# Altium project ESP32W_Zzed.PrjPcb
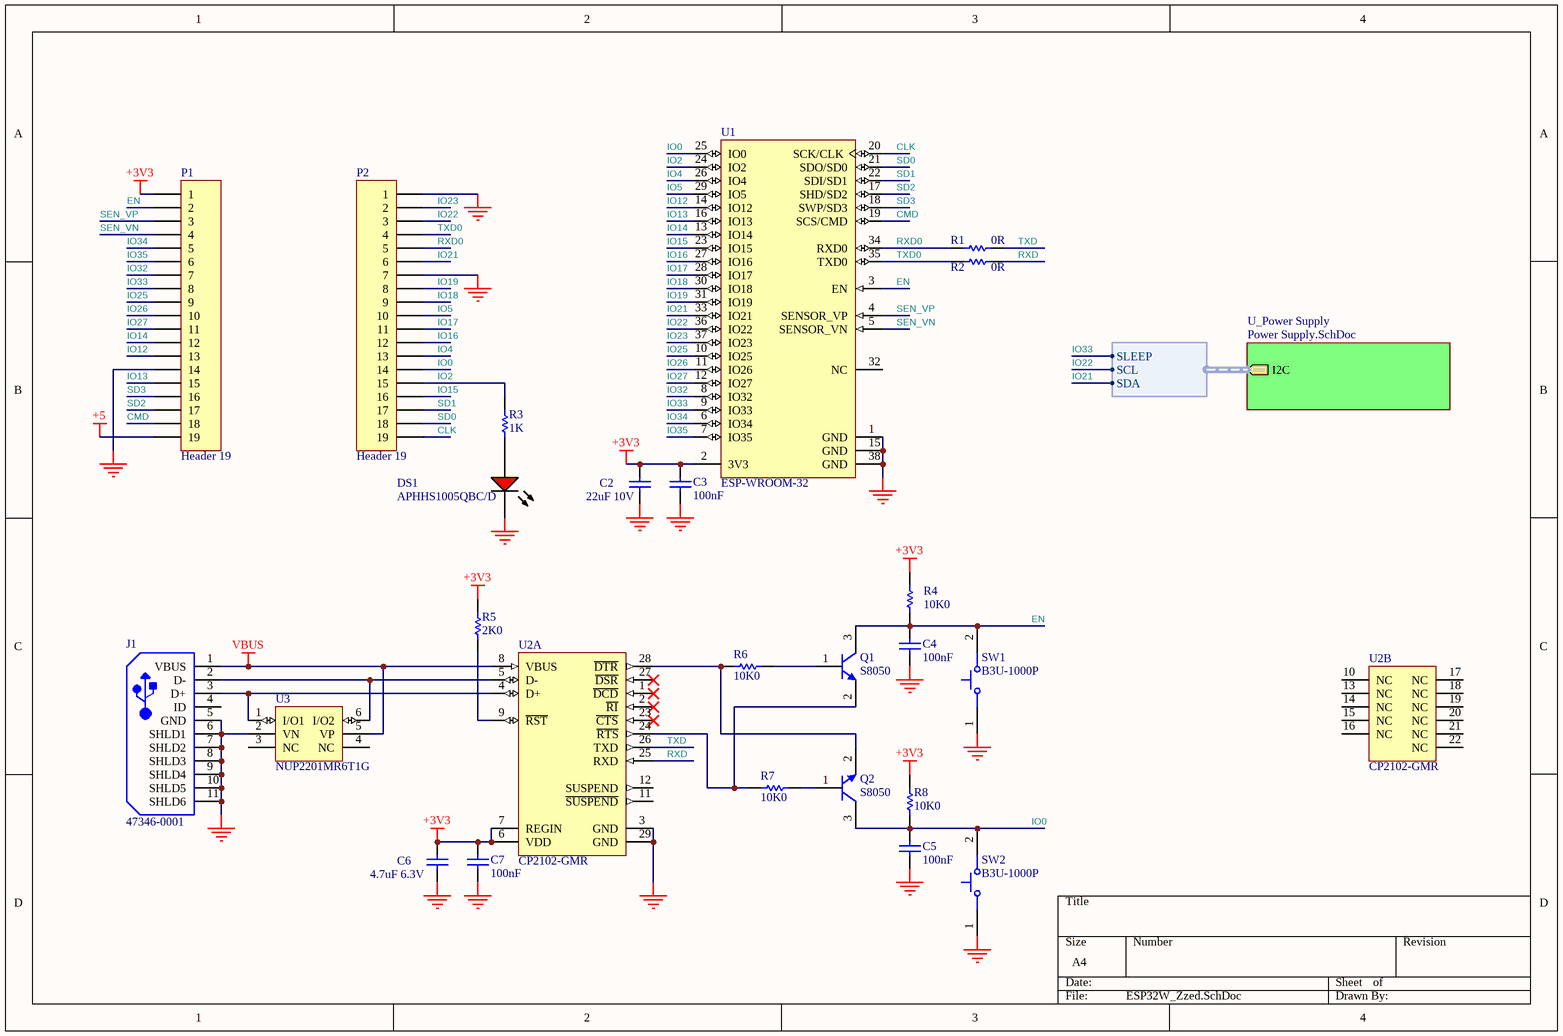
[diagram p0: ESP32W_Zzed.SchDoc]
2 sheets, 65 parts. Net scope: hierarchical (ports join the sheet entries above them; power ports are global).
Board file: ESP32W_Zzed.PcbDoc
Sheets:
  ESP32W_Zzed.SchDoc
    U_Power Supply = Power Supply.SchDoc

## Sheet ESP32W_Zzed.SchDoc
size A4

### Parts
C2  22uF 10V  [CAPC0805(2012)145_L]
C3  100nF  [CAPC0402(1005)60_L]
C4  100nF  [CAPC0402(1005)60_L]
C5  100nF  [CAPC0402(1005)60_L]
C6  4.7uF 6.3V  [CAPC0402(1005)60_L]
C7  100nF  [CAPC0402(1005)60_L]
DS1  APHHS1005QBC/D  [KING-0402_V]
J1  47346-0001  [MOLX-47346-0001-5_V]
P1  Header 19  [HDR1X19]
P2  Header 19  [HDR1X19]
Q1  S8050  [KOCN-SOT23-3_L]
Q2  S8050  [KOCN-SOT23-3_L]
R1  0R  [RESC0402(1005)_L]
R2  0R  [RESC0402(1005)_L]
R3  1K  [RESC0402(1005)_L]
R4  10K0  [RESC0402(1005)_L]
R5  2K0  [RESC0402(1005)_L]
R6  10K0  [RESC0402(1005)_L]
R7  10K0  [RESC0402(1005)_L]
R8  10K0  [RESC0402(1005)_L]
SW1  B3U-1000P  [OMRON-B3U-1000_V]
SW2  B3U-1000P  [OMRON-B3U-1000_V]
U1  ESP-WROOM-32  [OLMX-ESP-WROOM-32]
U2  CP2102-GMR  [SLAB-QFN-28-3125x3125TP_N]  (parts A,B of 2)
U3  NUP2201MR6T1G  [ONSC-TSOP-6_V]

### Sub-sheets
U_Power Supply = Power Supply.SchDoc: I2C (out, harness I2C)

### Harnesses
I2C: SLEEP, SCL, SDA

### Nets
+3V3: C2.2 C3.2 C6.2 C7.2 P1.1 R4.2 R5.2 R8.1 U1.2(3V3) U2.6(VDD) U2.7(REGIN)
+5: P1.19
GND: C2.1 C3.1 C4.1 C5.1 C6.1 C7.1 DS1.2(K) J1.5(GND) J1.6(SHLD1) J1.7(SHLD2) J1.8(SHLD3) J1.9(SHLD4) J1.10(SHLD5) J1.11(SHLD6) P1.14 P2.1 P2.7 SW1.1 SW2.1 U1.1(GND) U1.15(GND) U1.38(GND) U2.3(GND) U2.29(GND) U3.2(VN)
VBUS: J1.1(VBUS) U2.8(VBUS) U3.5(VP)
CLK: P2.19 U1.20(SCK/CLK)
CMD: P1.18 U1.19(SCS/CMD)
EN: C4.2 P1.2 Q1.3(COLLECTOR) R4.1 SW1.2 U1.3(EN)
IO0: C5.2 P2.14 Q2.3(COLLECTOR) R8.2 SW2.2 U1.25(IO0)
IO2: P2.15 R3.2 U1.24(IO2)
IO4: P2.13 U1.26(IO4)
IO5: P2.10 U1.29(IO5)
IO12: P1.13 U1.14(IO12)
IO13: P1.15 U1.16(IO13)
IO14: P1.12 U1.13(IO14)
IO15: P2.16 U1.23(IO15)
IO16: P2.12 U1.27(IO16)
IO17: P2.11 U1.28(IO17)
IO18: P2.9 U1.30(IO18)
IO19: P2.8 U1.31(IO19)
IO21: P2.6 U1.33(IO21) ; sheet U_Power Supply/I2C.SDA
IO22: P2.3 U1.36(IO22) ; sheet U_Power Supply/I2C.SCL
IO23: P2.2 U1.37(IO23)
IO25: P1.9 U1.10(IO25)
IO26: P1.10 U1.11(IO26)
IO27: P1.11 U1.12(IO27)
IO32: P1.7 U1.8(IO32)
IO33: P1.8 U1.9(IO33) ; sheet U_Power Supply/I2C.SLEEP
IO34: P1.5 U1.6(IO34)
IO35: P1.6 U1.7(IO35)
RXD: R2.2 U2.25(RXD)
RXD0: P2.5 R1.1 U1.34(RXD0)
SD0: P2.18 U1.21(SDO/SD0)
SD1: P2.17 U1.22(SDI/SD1)
SD2: P1.17 U1.17(SHD/SD2)
SD3: P1.16 U1.18(SWP/SD3)
SEN_VN: P1.4 U1.5(SENSOR_VN)
SEN_VP: P1.3 U1.4(SENSOR_VP)
TXD: R1.2 U2.26(TXD)
TXD0: P2.4 R2.1 U1.35(TXD0)
NetDS1_1: DS1.1(A) R3.1
NetJ1_2: J1.2(D-) U2.5(D-) U3.6(I/O2)
NetJ1_3: J1.3(D+) U2.4(D+) U3.1(I/O1)
NetQ1_1: Q1.1(BASE) R6.2
NetQ1_2: Q1.2(EMITTER) R7.1 U2.24(~{RTS})
NetQ2_1: Q2.1(BASE) R7.2
NetQ2_2: Q2.2(EMITTER) R6.1 U2.28(~{DTR})
NetR5_1: R5.1 U2.9(~{RST})

Not connected (* = marked no-connect by the designer): J1 4(ID); U1 32(NC); U2 1(~{DCD})* 2(~{RI})* 10(NC) 11(~{SUSPEND}) 12(SUSPEND) 13(NC) 14(NC) 15(NC) 16(NC) 17(NC) 18(NC) 19(NC) 20(NC) 21(NC) 22(NC) 23(~{CTS})* 27(~{DSR})*; U3 3(NC) 4(NC)

### Library data of the parts
C2 = CMP-1036-04942-1: CAP 22uF 10V ±10% 0805 (2012 Metric) Thickness 1.45mm SMD; Case-EIA: 0805; Case-Metric: 2012; Tolerance: Â±10%; Rated Voltage: 10 V; Max Thickness: 1.45 mm; Value: 22uF; Technology: SMT
C3-C5 C7 = CMP-1034-02077-1: CAP 100nF 50V ±10% 0402 (1005 Metric) Thickness 0.6mm SMD; Case-Metric: 1005; Case-EIA: 0402; Tolerance: Â±10%; Value: 100nF; Rated Voltage: 50 V; Technology: SMT; Max Thickness: 0.6 mm
C6 = CMP-1034-02137-1: CAP 4.7uF 6.3V ±20% 0402 (1005 Metric) Thickness 0.6mm SMD; Case-Metric: 1005; Case-EIA: 0402; Tolerance: Â±20%; Technology: SMT; Max Thickness: 0.6 mm; Rated Voltage: 6.3 V; Value: 4.7uF
DS1 = CMP-2000-05787-1: Red Water Clear Chip LED Lamp, 1.95 V, 20 mA, -40 to 85 degC, 2-Pin SMD (0402), RoHS, Tape and Reel; Manufacturer: Kingbright; Lens Style/Size: RectanglewithFlatTop,0.8mmx0.5mm; Wavelength - Dominant: 630nm; 3D Model: APHHS1005x.sldprt / APHHS1005x.pro / APHHS1005x.igs / APHHS1005x.stp; Current - Test: 20mA; Other Names: 754-1104-2; Millicandela Rating: 220mcd; Wavelength - Peak: 650nm; Online Catalog: 0402RectanglewithFlatTopChipLEDs; Viewing Angle: 120°; Voltage - Forward (Vf) (Typ): 1.95V; Catalog Drawings: APHHS1005SeriesSide / APHHS1005SeriesTop; Height: 0.60mm; Datasheet URL: https://datasheet.ciiva.com/4689/aphhs1005surck-32322-4689068.pdf; Datasheet Version: Rev. 8, 08/2010; Color: Red; Standard Package: 2,000; Packaging: Tape&Reel(TR); Manufacturer URL: http://www.kingbright.com/; Size / Dimension: 1.00mmLx0.50mmW; Package Description: 2-Pin Surface Mount Device, Body 1 x 0.5 mm; Package / Case: 0402(1005Metric); Family: LEDIndication-Discrete; Category: Optoelectronics; Lens Type: Clear; Mounting Technology: SurfaceMount; Package Reference: 0402; Mounting Type: SurfaceMount
J1 = CMP-2000-05246-1: Micro-USB B Receptacle with Flange, -30 to 85 degC, 5-Pin SMD, RoHS, Tape and Reel; Manufacturer: Molex; Number of Contacts: 5; Body Orientation: RightAngle; Maximum Voltage Rating: 30VAC; Pitch: 0.65mm; Maximum Current Rating: 1.8/ContactA; Number of Ports: 1; Gender: RCP; Operating Temperature: -30to85C; Part No: 47346-0001; Color: Black; Termination Method: Solder; Contact Plating: GoldOverPalladiumNickelOverNickel; Dimension: 7.8x5.43x2.94mm; Number of Terminals: 5; Datasheet Version: Dec-13; Datasheet URL: https://datasheet.ciiva.com/30075/304740473460001-io-nectors-30075527.pdf; Contact Material: CopperAlloy; RoHS: Yes; Housing Material: LiquidCrystalPolymer; Manufacturer URL: http://www.molex.com/; Packaging: EmbossedTapeandReel; Mounting: SurfaceMount; Type: MicroUSBTypeB
P1 P2 = Header 19: Header, 19-Pin; LatestRevisionDate: 17-Jul-2002; LatestRevisionNote: Re-released for DXP Platform.; Publisher: Altium Limited
Q1 Q2 = CMP-0564-00001-2: NPN Transistor, 0.8 A Collector Current, 3-Pin SOT23, RoHS, Tape and Reel; Manufacturer: Koo Chin; IEBO (max): 0.1 uA; V (BR) EBO (min): 5 V; VCE (sat) (max): 0.6 V; fT(min): 150 MHz; V (BR) CEO (min): 25 V; V (BR) CBO (min): 40 V; VBE (sat) (max): 1.2 V; NPN/PNP: NPN; PackageDescription: 3-Pin Small Out-Line Transistor, Body 1.3 x 2.9 mm, Pitch 0.95 mm; ComponentLink3Description: Package Specification; ComponentLink1Description: Manufacturer URL; RoHS: TRUE; ICEO (max): 0.1 uA; ComponentLink1URL: http://www.hz-dz.net/; PartNumber: S8050; ComponentLink2URL: http://www.hz-dz.net/UploadFiles/2009812164318190.pdf; Packing: Tape and Reel; ComponentLink3URL: http://galaxycn.com/jsp/upload/S8050.pdf; ICBO (max): 0.1 uA; Mounting Technology: Surface Mount; PackageReference: SOT23-3; ComponentLink2Description: Datasheet; DatasheetVersion: 17/08/2009
R1 R2 = CMP-1011-00001-1: Jumper 0402 (1005 Metric); Tolerance: None; Case-Metric: 1005; Case-EIA: 0402; Value: 0.00 Ohm; Power: None; Technology: SMT
R3 = CMP-1011-00510-1: 1K 0.063W 1% 0402 (1005 Metric)  SMD; Case-EIA: 0402; Value: 1000.00 Ohm; Case-Metric: 1005; Technology: SMT; Tolerance: 1 %; Power: 0.063 W
R4 R6-R8 = CMP-1011-00623-1: 10K 0.063W 1% 0402 (1005 Metric)  SMD; Case-Metric: 1005; Value: 10000.00 Ohm; Case-EIA: 0402; Tolerance: 1 %; Technology: SMT; Power: 0.063 W
R5 = CMP-1011-00542-1: 2K 0.063W 1% 0402 (1005 Metric)  SMD; Case-EIA: 0402; Case-Metric: 1005; Value: 2000.00 Ohm; Technology: SMT; Power: 0.063 W; Tolerance: 1 %
SW1 SW2 = CMP-2100-03586-1: Ultra-Small Tactile Switch, 0.05 A, 12 V, -25 to 70 degC, 2-Pin SMD, RoHS, Tape and Reel; Manufacturer: Omron Electronic Components; Operating Force: 1.5N; Current Rating: 50mA; Voltage Rating (DC): 12V; Electrical Life: 200000Cycles; Actuator Length: 0.4mm; Insulation Resistance: 100MOhm; Switch Travel: 0.15mm; Throw Configuration: SPST; Illumination Type: Illuminated; Width: 3mm; Weight: 0.022g; Datasheet Version: 42005.0; Datasheet URL: http://www.omron.com/ecb/products/pdf/en-b3u.pdf; Height: 1.2mm; Package Quantity: 1; REACH SVHC: Unknown; Contact Current Rating: 50mA; Contact Material: Silver; Max Current Rating: 50mA; Package Reference: B3U-1000; Termination: SMD/SMT; Packaging: TapeandReel; Manufacturer URL: http://www.omron.com/; RoHSCompliant: true; Mount: SurfaceMount; Length: 4mm; Min Operating Temperature: -25degC; Depth: 2.5mm; Lead Free: LeadFree; Case/Package: SMD/SMT; Package Description: 2-Pin Surface Mount Device, Body 3 x 2.5 mm; Max Operating Temperature: 70degC; Orientation: Straight
U1 = CMP-2000-07454-1: Espressif System, 2.7 to 3.6 V, -40 to 85 degC, 38-Pin SMD; Manufacturer: Olimex; Package Description: 38-Pin Surface Mount Device, Body 18 x 25.5 mm, Pitch 1.27 mm; Manufacturer URL: https://www.olimex.com; RoHSCompliant: false; Mounting Technology: SurfaceMount; Datasheet Version: Rev. 2.1, 09/2017; Datasheet URL: http://www.espressif.com/sites/default/files/documentation/esp-wroom-32_datasheet_en.pdf; Package Reference: ESP-WROOM-32
U2 = CMP-2000-04924-1: Single-Chip USB to URAT Bridge, 3.3 V, -40 to 85 degC, 28-Pin QFN, RoHS, Tape and Reel; Manufacturer: Silicon Labs; Interface Circuit Standard 1: RS-232; Transmitter and Receiver FIFO Counter: No; Supply Current: 26mA; Operating Supply Voltage (Min): 3V; Operating Supply Voltage (Typ): 3.3V; Data Rate: 1000kbps; Operating Supply Voltage (Max): 3.6V; Number of Channels: 1; Package URL: http://www.silabs.com/Support%20Documents/TechnicalDocs/C8051T61x.pdf; Operating Temperature (Max): 85C; Datasheet URL: http://www.mouser.com/ds/2/368/CP2102-9-247052.pdf; Operating Temperature Classification: Industrial; Operating Temperature (Min): -40C; Package Description: 28-Pin Quad-Flat No-Leads Package, Body 5 x 5 mm, Pitch 0.5 mm; Manufacturer URL: http://www.silabs.com/; Rad Hardened: No; Package Reference: QFN-28; Pin Count: 28; Packaging: TapeandReel; Mounting: SurfaceMount; Package Type: QFNEP; Datasheet Version: Rev. 1.6, 12/2013; PartId: 1
U3 = CMP-0260-00001-1: ESD Protection Diodes with Low Clamping Voltage; Peak Power Dissipation: 500 W; ComponentLink3Description: Package Specification; ComponentLink3URL: http://www.onsemi.com/pub_link/Collateral/318G-02.PDF; PartNumber: NUP2201MR6T1G; Mounting Technology: Surface Mount; ComponentLink1Description: Manufacturer URL; ComponentLink2URL: http://www.onsemi.cn/pub_link/Collateral/NUP2201MR6-D.PDF; PackageDescription: 6-Pin Thin Small Outline, 3 x 1.5 mm Body, 0.95 mm Pitch; ComponentLink2Description: Datasheet; ComponentLink1URL: http://www.onsemi.com/; Storage Temperature: -55 to 125 degC; DatasheetVersion: Rev. 4, 02/2013; PackageReference: TSOP-6; PackageVersion: Rev. V, 6/2012

## Sheet Power Supply.SchDoc
size A4
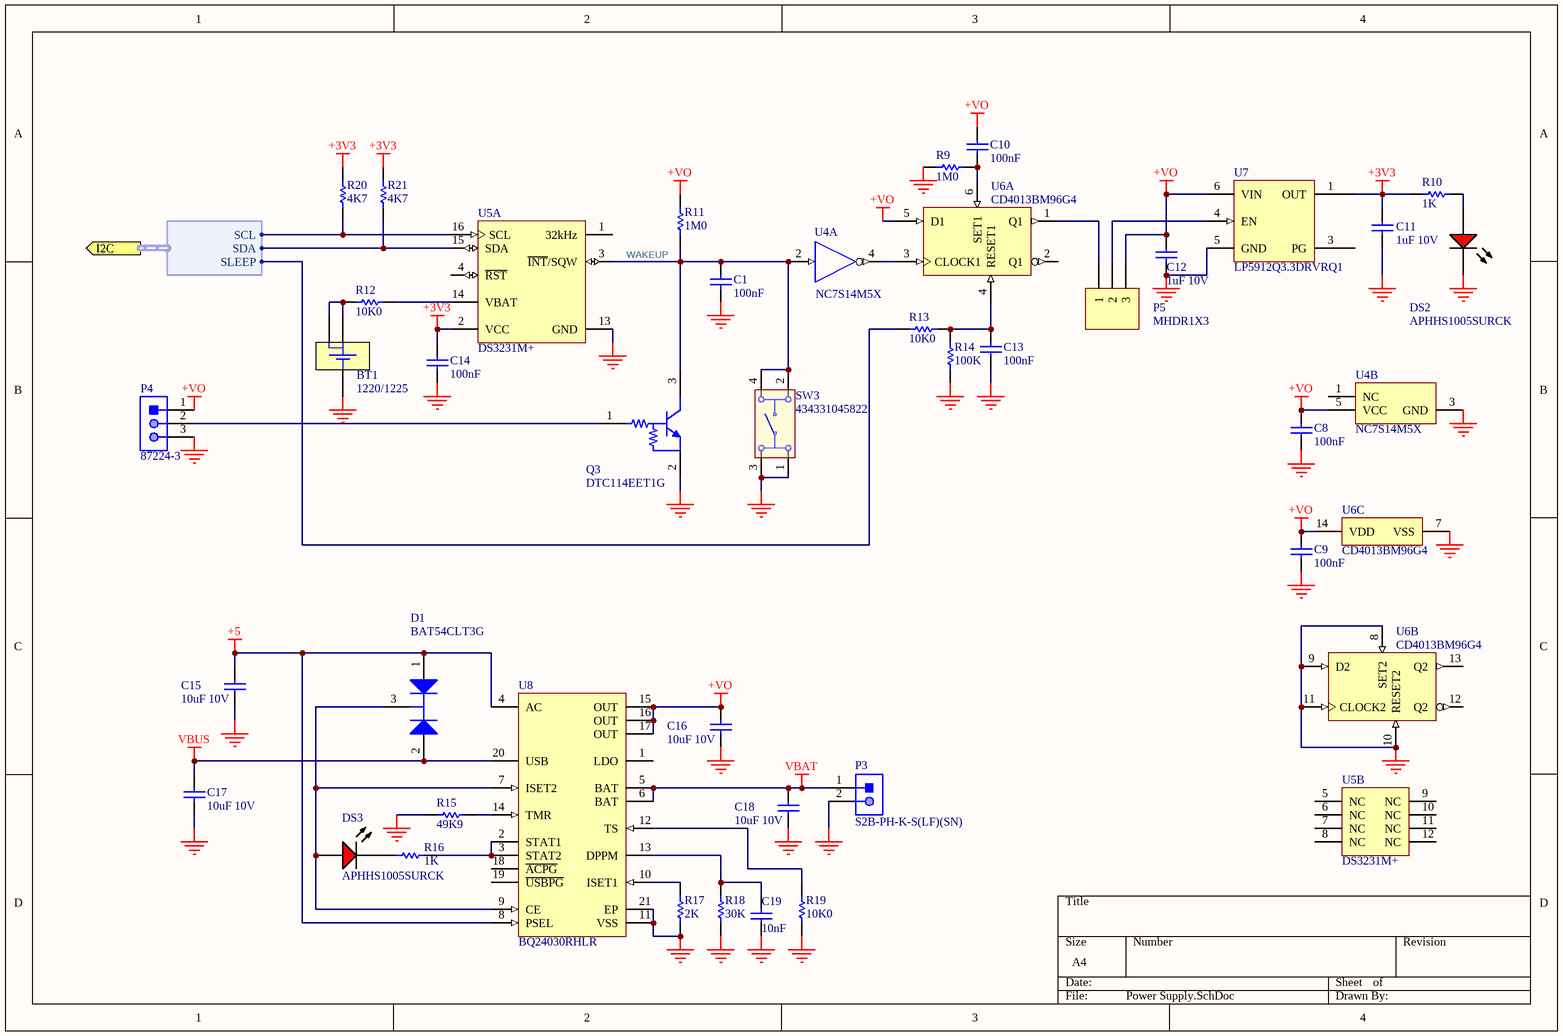
[diagram p1: Power Supply.SchDoc]

### Parts
BT1  1220/1225  [KEYSTONE 3000]
C1  100nF  [CAPC0402(1005)60_L]
C8  100nF  [CAPC0402(1005)60_L]
C9  100nF  [CAPC0402(1005)60_N]
C10  100nF  [CAPC0402(1005)60_L]
C11  1uF 10V  [CAPC0402(1005)60_L]
C12  1uF 10V  [CAPC0402(1005)60_L]
C13  100nF  [CAPC0402(1005)60_L]
C14  100nF  [CAPC0402(1005)60_L]
C15  10uF 10V  [CAPC0603(1608)100_L]
C16  10uF 10V  [CAPC0603(1608)100_L]
C17  10uF 10V  [CAPC0603(1608)100_L]
C18  10uF 10V  [CAPC0603(1608)100_L]
C19  10nF  [CAPC0402(1005)60_L]
D1  BAT54CLT3G  [ONSC-SOT-23-3-318-08_V]
DS2  APHHS1005SURCK  [KING-0402_V]
DS3  APHHS1005SURCK  [KING-0402_V]
P3  S2B-PH-K-S(LF)(SN)  [JST-S2B-PH-K-S_V]
P4  87224-3  [TECO-87224-3_V]
P5  MHDR1X3  [MHDR1X3]
Q3  DTC114EET1G  [ONSC-SC-75-3-463-01_V]
R9  1M0  [RESC0402(1005)_L]
R10  1K  [RESC0402(1005)_L]
R11  1M0  [RESC0402(1005)_L]
R12  10K0  [RESC0402(1005)_L]
R13  10K0  [RESC0402(1005)_L]
R14  100K  [RESC0402(1005)_L]
R15  49K9  [RESC0402(1005)_L]
R16  1K  [RESC0402(1005)_L]
R17  2K  [RESC0402(1005)_L]
R18  30K  [RESC0402(1005)_L]
R19  10K0  [RESC0402(1005)_L]
R20  4K7  [RESC0402(1005)_L]
R21  4K7  [RESC0402(1005)_L]
SW3  434331045822  [434331045822]
U4  NC7S14M5X  [FAIR-SOT23-5_V]  (parts A,B of 2)
U5  DS3231M+  [W16MK+1_N]  (parts A,B of 2)
U6  CD4013BM96G4  [D0014A_L]  (parts A,B,C of 3)
U7  LP5912Q3.3DRVRQ1  [WSON65P200X80_HS-7N]
U8  BQ24030RHLR  [RHL0020A_V]

### Ports
I2C (out, harness I2C)

### Harnesses
I2C: SLEEP, SCL, SDA

### Nets
+3V3: C11.1 C14.2 R10.1 R20.2 R21.2 U5.2(VCC) U7.1(OUT)
+5: C15.1 D1.1(A1) U8.4(AC) U8.8(PSEL)
+VO: C8.2 C9.2 C10.2 C12.1 C16.1 P4.1 P5.3 R11.2 U4.5(VCC) U6.5(D1) U6.14(VDD) U7.6(VIN) U8.15(OUT) U8.16(OUT) U8.17(OUT)
GND: BT1.2(-) C1.1 C8.1 C9.1 C11.2 C12.2 C13.1 C14.1 C15.2 C16.2 C17.2 C18.2 C19.1 DS2.2(K) P3.2 P4.3 Q3.2(E) R9.2 R14.1 R15.1 R17.1 R18.1 R19.1 SW3.1 SW3.3 U4.3(GND) U5.13(GND) U6.7(VSS) U6.8(SET2) U6.9(D2) U6.10(RESET2) U6.11(CLOCK2) U7.5(GND) U8.11(VSS) U8.21(EP)
VBAT: C18.1 P3.1 U8.5(BAT) U8.6(BAT)
VBUS: C17.1 D1.2(A2) U8.20(USB)
IO21: R21.1 U5.15(SDA) ; port I2C.SDA
IO22: R20.1 U5.16(SCL) ; port I2C.SCL
IO33: R13.1 ; port I2C.SLEEP
WAKEUP: C1.2 Q3.3(C) R11.1 SW3.2 SW3.4 U4.2(A) U5.3(~{INT}/SQW)
NetBT1_1: BT1.1(+) BT1.3(+) R12.2
NetC10_1: C10.1 R9.1 U6.6(SET1)
NetC13_2: C13.2 R13.2 R14.2 U6.4(RESET1)
NetC19_2: C19.2 R18.2 U8.13(DPPM)
NetD1_3: D1.3(K) DS3.1(A) U8.7(ISET2) U8.9(CE)
NetDS2_1: DS2.1(A) R10.2
NetDS3_2: DS3.2(K) R16.1
NetP4_2: P4.2 Q3.1(B)
NetP5_1: P5.1 U6.1(Q1)
NetP5_2: P5.2 U7.4(EN)
NetR12_1: R12.1 U5.14(VBAT)
NetR15_2: R15.2 U8.14(TMR)
NetR16_2: R16.2 U8.2(STAT1) U8.3(STAT2)
NetR17_2: R17.2 U8.10(ISET1)
NetR19_2: R19.2 U8.12(TS)
NetU4_4: U4.4(Y) U6.3(CLOCK1)

Not connected (* = marked no-connect by the designer): U4 1(NC); U5 1(32kHz) 4(~{RST}) 5(NC) 6(NC) 7(NC) 8(NC) 9(NC) 10(NC) 11(NC) 12(NC); U6 2(Q1) 12(Q2) 13(Q2); U7 3(PG); U8 1(LDO) 18(~{ACPG}) 19(~{USBPG})

### Library data of the parts
BT1 = 3000: Keystone 3000
C1 C8-C10 C13 C14 = CMP-1034-02077-1: as C3 on sheet ESP32W_Zzed; Value: 100nF; Rated Voltage: 50 V; Technology: SMT; Max Thickness: 0.6 mm
C11 C12 = CMP-1034-02116-1: CAP 1uF 10V ±10% 0402 (1005 Metric) Thickness 0.6mm SMD; Tolerance: Â±10%; Case-Metric: 1005; Case-EIA: 0402; Value: 1uF; Technology: SMT; Max Thickness: 0.6 mm; Rated Voltage: 10 V
C15-C18 = CMP-1035-02800-1: CAP 10uF 10V ±20% 0603 (1608 Metric) Thickness 1mm SMD; Tolerance: Â±20%; Case-EIA: 0603; Case-Metric: 1608; Max Thickness: 1 mm; Rated Voltage: 10 V; Technology: SMT; Value: 10uF
C19 = CMP-1034-01886-1: CAP 10nF 50V ±10% 0402 (1005 Metric) Thickness 0.6mm SMD; Tolerance: Â±10%; Case-EIA: 0402; Case-Metric: 1005; Value: 10nF; Rated Voltage: 50 V; Max Thickness: 0.6 mm; Technology: SMT
D1 = CMP-1055-00545-1: Dual Common Cathode Schottky Barrier Diodes, 3-Pin SOT-23, Pb-Free, Tape and Reel; Manufacturer: On Semiconductor; IFSM Max (A): 0.6; trr Max (ns): 5; ComponentLink3Description: Package Specification; PackageDescription: 3-Pin Small Outline Transistor, Body 2.92 x 1.3 mm, Pitch 0.95 mm; PartNumber: BAT54CLT3G; Packing: Tape and Reel; ComponentLink1URL: http://www.onsemi.com/; ComponentLink2URL: http://www.onsemi.cn/pub_link/Collateral/BAT54CLT1-D.PDF; RoHS: TRUE; PackageReference: SOT-23-3-318-08; DatasheetVersion: Rev. 8; PackageVersion: Rev. AP, 11/2009; ComponentLink3URL: http://www.onsemi.cn/pub_link/Collateral/318-08.PDF; Configuration: Common Cathode; ComponentLink2Description: Datasheet; Mounting Technology: Surface Mount; ComponentLink1Description: Manufacturer URL
DS2 DS3 = CMP-2000-05787-1: as DS1 on sheet ESP32W_Zzed; Height: 0.60mm; Datasheet URL: https://datasheet.ciiva.com/4689/aphhs1005surck-32322-4689068.pdf; Datasheet Version: Rev. 8, 08/2010; Color: Red; Standard Package: 2,000; Packaging: Tape&Reel(TR); Manufacturer URL: http://www.kingbright.com/; Size / Dimension: 1.00mmLx0.50mmW; Package Description: 2-Pin Surface Mount Device, Body 1 x 0.5 mm; Package / Case: 0402(1005Metric); Family: LEDIndication-Discrete; Category: Optoelectronics; Lens Type: Clear; Mounting Technology: SurfaceMount; Package Reference: 0402; Mounting Type: SurfaceMount
P3 = CMP-1755-00004-1: Male Header, Pitch 2 mm, 1 x 2 Position, Height 4.8 mm, Tail Length 3.4 mm, -25 to 85 degC, RoHS, Bulk; Case\Package: Radial; Tolerance: 20%; Capacitance: 10 uF; Voltage Rating (DC): 50 V; Packaging: Bulk; ComponentLink1URL: http://www.jst-mfg.com/product/pdf/eng/ePH.pdf; Radiation Hardening: No; Height: 11 mm; Package Quantity: 200; PackageDescription: Male Header, Pitch 2 mm, 1 x 2 Position, Height 4.8 mm, Tail Length 3.4 mm; PackageReference: S2B-PH-K-S; Diameter: 5 mm; Pins: 2; Mount: Through Hole; Max Operating Temperature: 85 degC; Min Operating Temperature: -40 degC; ComponentLink1Description: Datasheet; DatasheetVersion: Dec-12; Length: 11 mm; Lead Pitch: 2 mm; REACH SVHC: No SVHC; Voltage Rating: 50 V; RoHSCompliant: true
P4 = CMP-2000-05697-1: Male Header, Pitch 2.54 mm, 1 x 3 Position, Height 10.744 mm, Tail Length 3.175 mm, -65 to 105 degC, RoHS, Bulk; Manufacturer: TE Connectivity; Catalog Drawings: SingleSquareStraightPost / SingleSquareStraightPostSide; Connector Type: Header,Unshrouded; Pitch: 0.100"(2.54mm); Mating Products: 147738-2-ND / -CONNRCPT3POSVERTSMDGOLD / 147723-2-ND / -CONNRCPT3POSVERT.100GOLD / 146763-5-ND / -CONNRCPT3POSSGLVERT.100T/H / A32904-ND / -CONNRECEPT3POS.100VERTGOLD / A26922-ND / -CONNHOUSING3POS.100LOCKING / A26415-ND / -CONNRECEPT3POS.100VERTAU / A26964-ND / -CONNHOUSING3POS.100SINGLE / A3012-ND / -CONNHOUSING3POS.100SINGLE; Number of Positions Loaded: All; Featured Product: AMPMODUConnectors; Dynamic Catalog: AMPMODUModIISeries; 3D Model: 87224-3.pdf; Other Names: 87224-3-ND / A26545; Number of Positions: 3; RoHS Information: 87224-3StatementofCompliance; Termination: Solder; Datasheet URL: http://www.te.com/commerce/DocumentDelivery/DDEController?Action=showdoc&DocId=Customer+Drawing%7F87224%7FL3%7Fpdf%7FEnglish%7FENG_CD_87224_L3.pdf%7F87224-3; Category: Connectors,Interconnects; Contact Mating Length: 0.318"(8.08mm); Standard Package: 520; Mounting Type: ThroughHole; Family: RectangularConnectors-Headers,MalePins; Number of Rows: 1; Series: AMPMODUModII; Contact Finish Thickness: 15µin(0.38µm); Datasheet Version: Rev. L3, 08/2015; Package Reference: 87224-3; Mounting Technology: ThroughHole; Manufacturer URL: http://www.te.com/; Contact Type: MalePin; Packaging: Bulk; Color: Black; Package Description: Male Header, Pitch 2.54 mm, 1 x 3 Position, Height 10.744 mm, Tail Length 3.175 mm; Contact Finish: Gold
P5 = MHDR1X3: Header, 3-Pin; LatestRevisionDate: 17-Jul-2002; LatestRevisionNote: Re-released for DXP Platform.; Publisher: Altium Limited
Q3 = CMP-0630-00210-1: Digital Transistor (BRT), R1=10 kOhm, R2=10 kOhm, NPN Transistor, 3-Pin SC-75, Pb-Free, Tape and Reel; Manufacturer: On Semiconductor; IC Continuous (A): 0.1; hFE Min: 35; V(BR)CEO Min (V): 50; R1/R2 Typ: 1; Mounting Technology: Surface Mount; RoHS: TRUE; Packing: Tape and Reel; DatasheetVersion: Rev. 5; ComponentLink1Description: Manufacturer URL; ComponentLink3Description: Package Specification; PartNumber: DTC114EET1G; PackageReference: SC-75-3-463-01; PackageVersion: Rev. F, 07/2005; ComponentLink1URL: http://www.onsemi.com/; Polarity: NPN; ComponentLink3URL: http://www.onsemi.com/pub_link/Collateral/463-01.PDF; ComponentLink2Description: Datasheet; PackageDescription: 3-Pin Small Outline Transistor, Body 1.6 x 0.8 mm, Pitch 0.5 mm; ComponentLink2URL: http://www.onsemi.cn/pub_link/Collateral/DTC114E-D.PDF
R9 R11 = CMP-1011-00849-1: 1M 0.063W 1% 0402 (1005 Metric)  SMD; Case-Metric: 1005; Value: 1000000.00 Ohm; Case-EIA: 0402; Tolerance: 1 %; Power: 0.063 W; Technology: SMT
R10 R16 = CMP-1011-00510-1: as R3 on sheet ESP32W_Zzed; Technology: SMT; Tolerance: 1 %; Power: 0.063 W
R12 R13 R19 = CMP-1011-00623-1: as R4 on sheet ESP32W_Zzed; Tolerance: 1 %; Technology: SMT; Power: 0.063 W
R14 = CMP-1011-00736-1: 100K 0.063W 1% 0402 (1005 Metric)  SMD; Value: 100000.00 Ohm; Case-EIA: 0402; Case-Metric: 1005; Power: 0.063 W; Tolerance: 1 %; Technology: SMT
R15 = CMP-1011-00702-1: 49K9 0.063W 1% 0402 (1005 Metric)  SMD; Case-Metric: 1005; Value: 49900.00 Ohm; Case-EIA: 0402; Power: 0.063 W; Tolerance: 1 %; Technology: SMT
R17 = CMP-1011-00542-1: as R5 on sheet ESP32W_Zzed; Technology: SMT; Power: 0.063 W; Tolerance: 1 %
R18 = CMP-1011-00675-1: 30K 0.063W 1% 0402 (1005 Metric)  SMD; Value: 30000.00 Ohm; Case-Metric: 1005; Case-EIA: 0402; Power: 0.063 W; Technology: SMT; Tolerance: 1 %
R20 R21 = CMP-1011-00586-1: 4K7 0.063W 1% 0402 (1005 Metric)  SMD; Case-Metric: 1005; Value: 4700.00 Ohm; Case-EIA: 0402; Power: 0.063 W; Technology: SMT; Tolerance: 1 %
SW3 = CMP-1461-00001-1: WS-TASU SMD Tact Switch 4.7X3.5 mm side push; Manufacturer: Wuerth Elektronik; NoPins: 04; ComponentLink1Description: Manufacturer URL; ComponentLink2Description: Datasheet; PartNumber: 434331045822; PackageReference: 434331045822; ComponentLink2URL: http://katalog.we-online.de/em/datasheet/434331045822.pdf; ComponentLink1URL: http://www.we-online.com
U4 = CMP-2000-06808-1: TinyLogic HS Inverter with Schmitt Trigger Input, 2 to 6 V, -40 to 85 degC, 5-Pin SOT23, RoHS, Tape and Reel; Manufacturer: Fairchild Semiconductor; Dynamic Catalog: 7S; Max Propagation Delay @ V, Max CL: 17ns@6V,50pF; Package Version: 08/2015; Logic Level - Low: 0.3V~1.5V; Voltage - Supply: 2V~6V; Logic Level - High: 1.5V~4.2V; Number of Circuits: 1; Current - Output High, Low: 2.6mA,2.6mA; Logic Type: Inverter,Buffer; Current - Quiescent (Max): 1µA; Product Change Notification: MoldCompoundChange12/Dec/2007; Other Names: NC7S14M5XTR; Packaging: Tape&Reel(TR); Datasheet Version: 08/2004; Standard Package: 3,000; Category: IntegratedCircuits(ICs); Mounting Technology: SurfaceMount; Package URL: https://www.fairchildsemi.com/package-drawings/MA/MA05B.pdf; Operating Temperature: -40°C~85°C; Manufacturer URL: https://www.fairchildsemi.com/; Supplier Device Package: SOT-23-5; Features: SchmittTrigger; Package / Case: SC-74A,SOT-753; Datasheet URL: https://www.fairchildsemi.com/datasheets/NC/NC7S14.pdf; Package Description: 5-Pin Small Outline Transistor, Body 2.9 x 1.6 mm, Pitch 0.95 mm; Number of Inputs: 1; Package Reference: SOT23-5; Family: Logic-GatesandInverters; Series: 7S; Mounting Type: SurfaceMount; PartId: 1
U5 = CMP-0254-00003-2: +/-5ppm, MEMS based Real-Time Clock, I2C Interface, 16-Pin SO, -40 to 85 degC, Pb-Free; ComponentLink1Description: Manufacturer URL; PackageReference: W16MK+1; DatasheetVersion: Rev 3, Dec-2011; PackageDescription: 16-Pin Small-Outline IC, Wide (0.3in), 1.27 mm Pitch, SOIC (W), Pb-Free; ComponentLink3Description: Package Specification; ComponentLink2URL: http://datasheets.maxim-ic.com/en/ds/DS3231M.pdf; PackageVersion: revD, 2010; ComponentLink1URL: http://www.maxim-ic.com; Code_IPC: SOIC127P1030-16; ComponentLink2Description: Datasheet; ComponentLink3URL: http://pdfserv.maxim-ic.com/package_dwgs/21-0042.PDF; Code_JEDEC: MS-013-AA; PartId: 1
U6 = CMP-1619-00046-2: CMOS Dual D-Type Flip Flop, D0014A, LARGE T&R; Manufacturer: Texas Instruments; Output Logic: Inverted,Non-inverted; F @ Nom Voltage(Max)(Mhz): 8; ICC @ Nom Voltage(Max)(mA): 0.06; Voltage(Nom)(V): 10; Bits(#): 2; 3-State Output: No; tpd @ Nom Voltage(Max)(ns): 130; Technology Family: CD4000; VCC(Max)(V): 18; Rating: Military; Output Drive (IOL/IOH)(Max)(mA): 1.5/-1.5; VCC(Min)(V): 3; Input Type: CMOS; DatasheetVersion: SCHS023D; Code_JEDEC: MS-012; Operating Temperature Range(C): -55 to 125; PackageReference: D0014A; Output Type: CMOS; Schmitt Trigger: No; Generic Part Number: CD4013B; PartId: 1
U7 = LP5912Q3.3DRVRQ1: Linear Voltage Regulator IC 1 Output 500mA 6-WSON (2x2)
U8 = CMP-0321-00129-2: Dual Input Li-Ion Charger with Dynamic Power-Path Management, Output regulated to 6 V, Vbat 4.2 V, 4.3 V, -40 to 85 degC, 20-pin QFN (RHL), Green (RoHS & no Sb/Br); Manufacturer: Texas Instruments; Lead Acid: N; Vin(Min)(V): 4.3; Li-Ion: Y; SubFamily: Battery Charge Management; PartNumber: BQ24030RHLR; ComponentLink1URL: http://www.ti.com/general/docs/lit/getliterature.tsp?genericPartNumber=BQ24030&fileType=pdf; Mounting Technology: Surface Mount; PackageVersion: revJ, Dec-2011; PackageDescription: 20-Leads Plastic Quad Flatpack No-Lead, 4.5 x 3.5 x 0.9 mm Body, 0.5 mm Pitch, Exposed Pad; PackageReference: RHL0020A; NiCd: N; DatasheetVersion: SLUS618H; Li-Polymer: Y; ComponentLink1Description: Datasheet; NiMH: N; Over Voltage Protection: N; Eco-Plan: Green (RoHS & no Sb/Br)

## Nets that join several sheets
+3V3: ESP32W_Zzed (11 pins), Power Supply (7 pins)
+5: ESP32W_Zzed (P1.19), Power Supply (C15.1 D1.1 U8.4 U8.8)
GND: ESP32W_Zzed (25 pins), Power Supply (35 pins)
VBUS: ESP32W_Zzed (J1.1 U2.8 U3.5), Power Supply (C17.1 D1.2 U8.20)
IO21: ESP32W_Zzed (P2.6 U1.33), Power Supply (R21.1 U5.15)
IO22: ESP32W_Zzed (P2.3 U1.36), Power Supply (R20.1 U5.16)
IO33: ESP32W_Zzed (P1.8 U1.9), Power Supply (R13.1)

## Assembly variants
Ver1: not fitted P4 P5